# Altium schematic sheet ADC MUX.SchDoc
size 406 x 304 mm; SheetNumber: 12; SheetTotal: 18
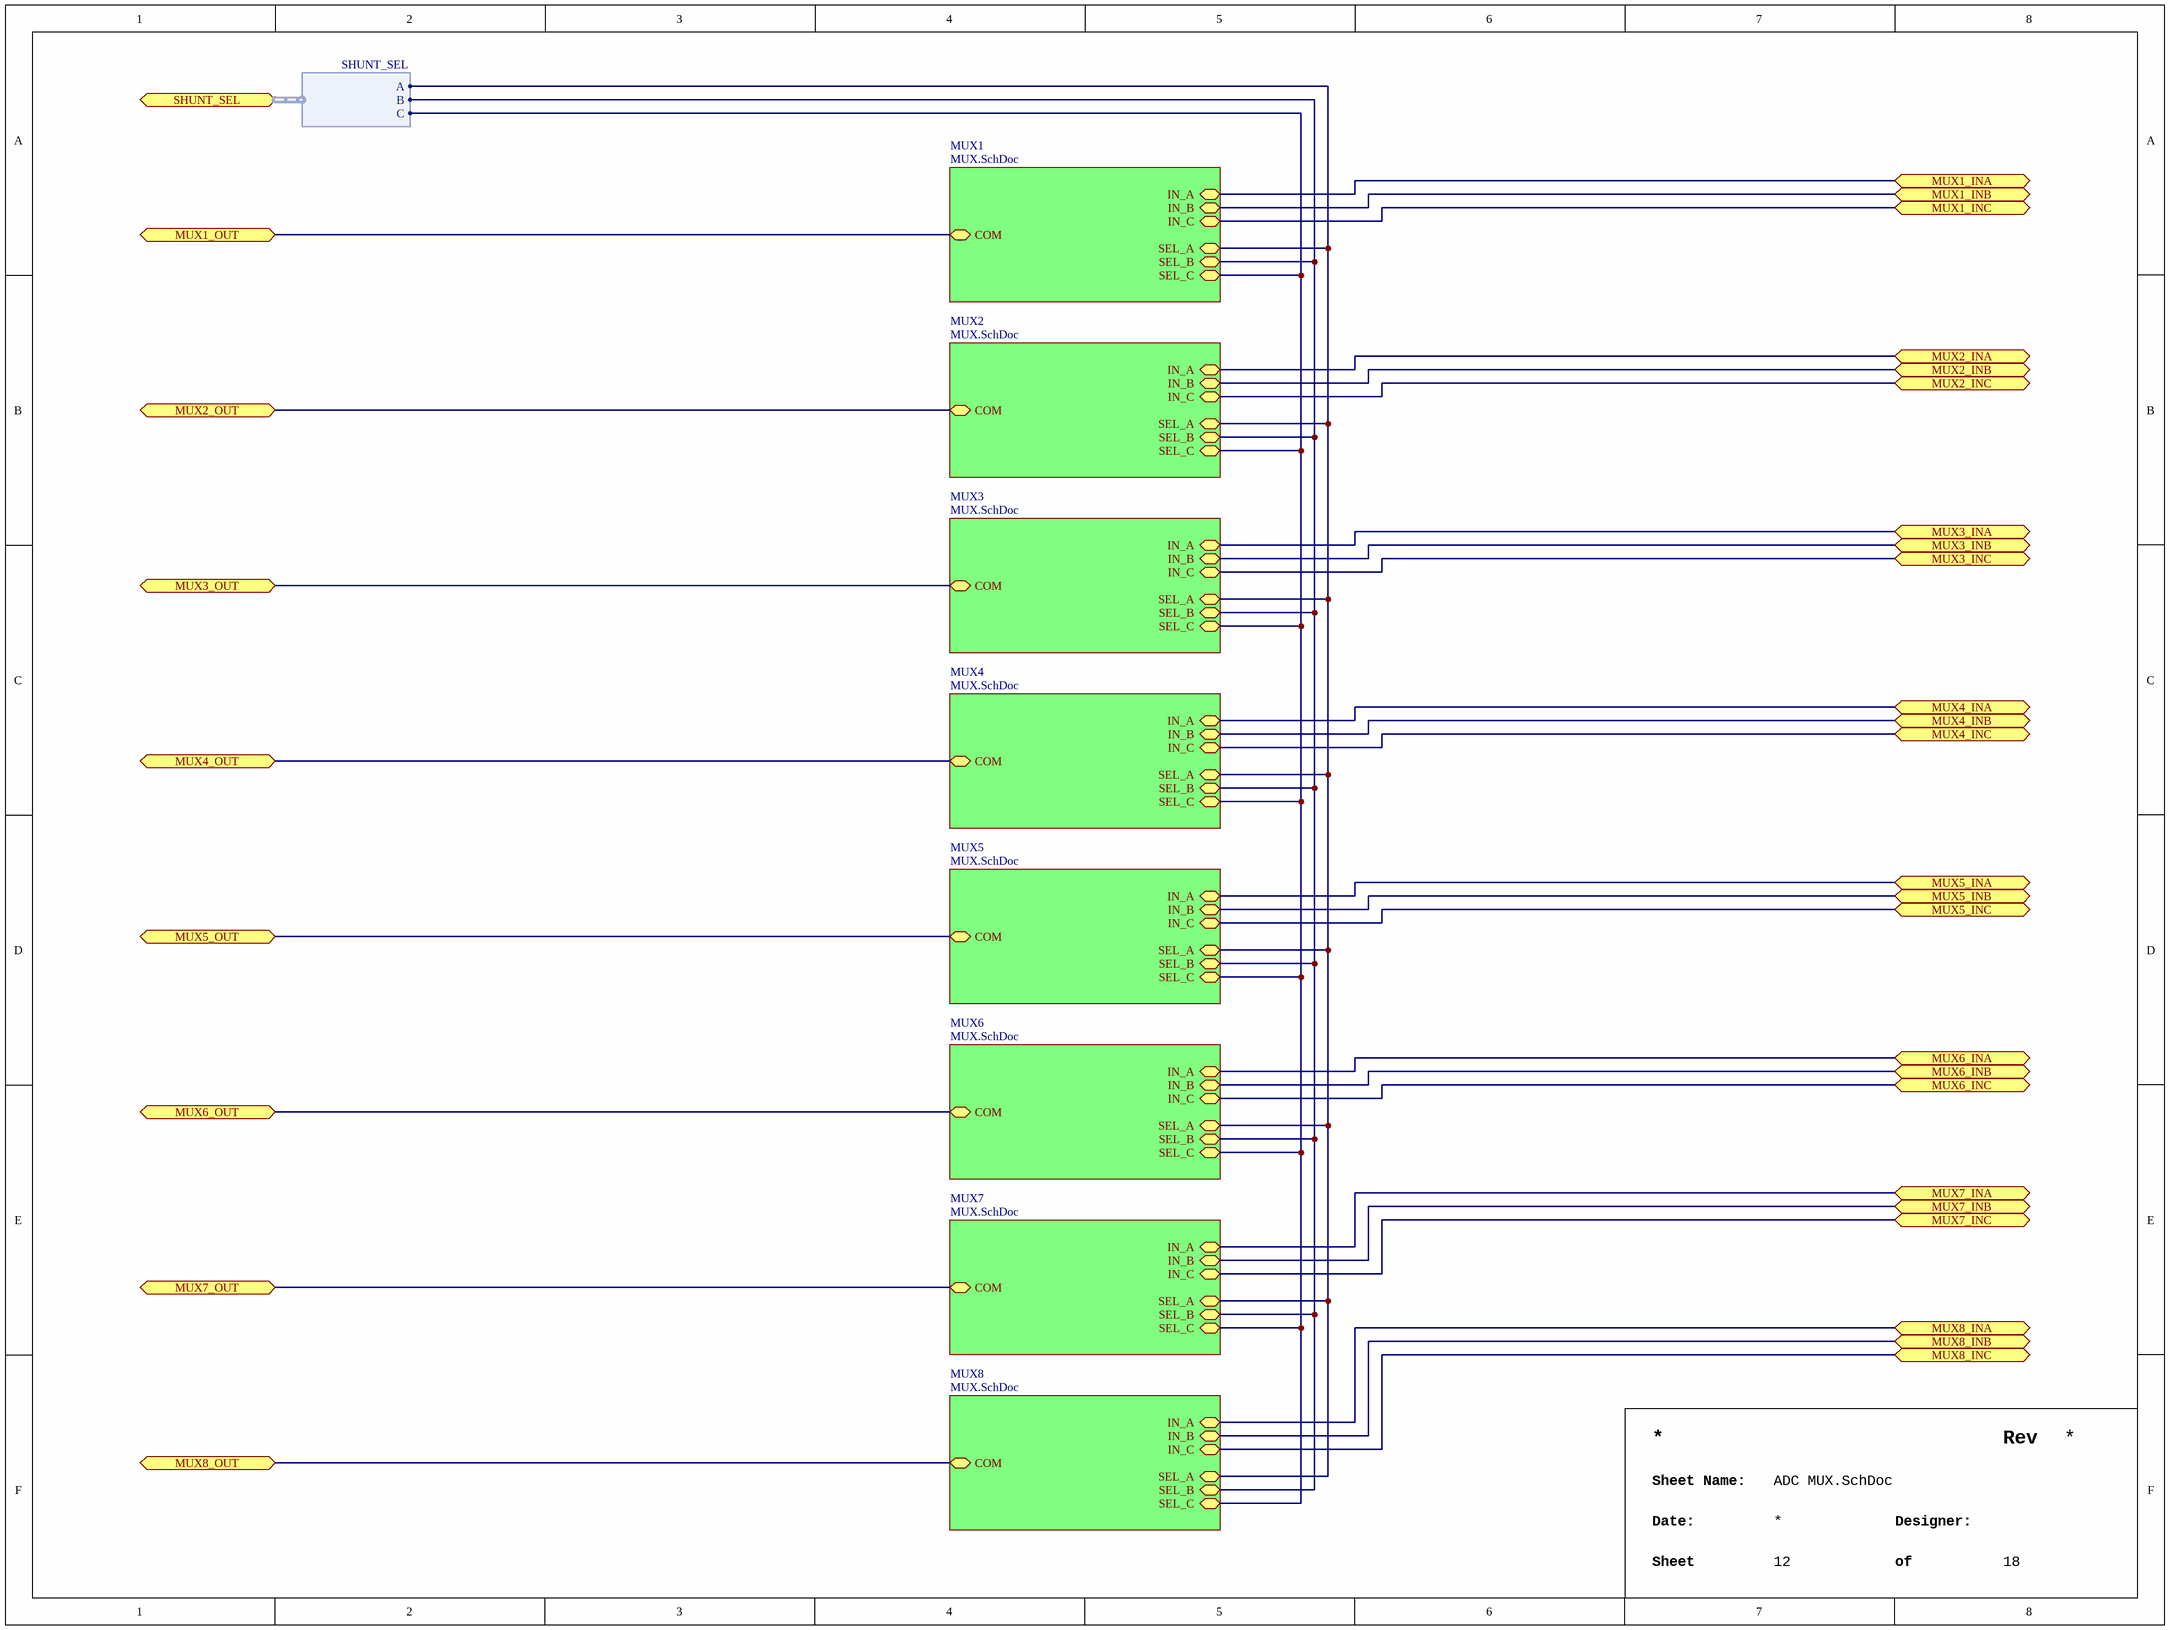
[diagram p0: ADC MUX.SchDoc]

## Sub-sheets
MUX1 = MUX.SchDoc: COM (bidir), IN_A (bidir), IN_B (bidir), IN_C (bidir), SEL_A (bidir), SEL_B (bidir), SEL_C (bidir)
MUX2 = MUX.SchDoc: COM (bidir), IN_A (bidir), IN_B (bidir), IN_C (bidir), SEL_A (bidir), SEL_B (bidir), SEL_C (bidir)
MUX3 = MUX.SchDoc: COM (bidir), IN_A (bidir), IN_B (bidir), IN_C (bidir), SEL_A (bidir), SEL_B (bidir), SEL_C (bidir)
MUX4 = MUX.SchDoc: COM (bidir), IN_A (bidir), IN_B (bidir), IN_C (bidir), SEL_A (bidir), SEL_B (bidir), SEL_C (bidir)
MUX5 = MUX.SchDoc: COM (bidir), IN_A (bidir), IN_B (bidir), IN_C (bidir), SEL_A (bidir), SEL_B (bidir), SEL_C (bidir)
MUX6 = MUX.SchDoc: COM (bidir), IN_A (bidir), IN_B (bidir), IN_C (bidir), SEL_A (bidir), SEL_B (bidir), SEL_C (bidir)
MUX7 = MUX.SchDoc: COM (bidir), IN_A (bidir), IN_B (bidir), IN_C (bidir), SEL_A (bidir), SEL_B (bidir), SEL_C (bidir)
MUX8 = MUX.SchDoc: COM (bidir), IN_A (bidir), IN_B (bidir), IN_C (bidir), SEL_A (bidir), SEL_B (bidir), SEL_C (bidir)

## Ports
MUX1_INA (bidir), MUX1_INB (bidir), MUX1_INC (bidir), MUX1_OUT (bidir), MUX2_INA (bidir), MUX2_INB (bidir), MUX2_INC (bidir), MUX2_OUT (bidir), MUX3_INA (bidir), MUX3_INB (bidir), MUX3_INC (bidir), MUX3_OUT (bidir), MUX4_INA (bidir), MUX4_INB (bidir), MUX4_INC (bidir), MUX4_OUT (bidir), MUX5_INA (bidir), MUX5_INB (bidir), MUX5_INC (bidir), MUX5_OUT (bidir), MUX6_INA (bidir), MUX6_INB (bidir), MUX6_INC (bidir), MUX6_OUT (bidir), MUX7_INA (bidir), MUX7_INB (bidir), MUX7_INC (bidir), MUX7_OUT (bidir), MUX8_INA (bidir), MUX8_INB (bidir), MUX8_INC (bidir), MUX8_OUT (bidir), SHUNT_SEL (bidir, harness SHUNT_SEL)

## Harnesses
SHUNT_SEL: A, B, C

## Nets
MUX1_INA: port MUX1_INA, sheet MUX1/IN_A
MUX1_INB: port MUX1_INB, sheet MUX1/IN_B
MUX1_INC: port MUX1_INC, sheet MUX1/IN_C
MUX1_OUT: port MUX1_OUT, sheet MUX1/COM
MUX2_INA: port MUX2_INA, sheet MUX2/IN_A
MUX2_INB: port MUX2_INB, sheet MUX2/IN_B
MUX2_INC: port MUX2_INC, sheet MUX2/IN_C
MUX2_OUT: port MUX2_OUT, sheet MUX2/COM
MUX3_INA: port MUX3_INA, sheet MUX3/IN_A
MUX3_INB: port MUX3_INB, sheet MUX3/IN_B
MUX3_INC: port MUX3_INC, sheet MUX3/IN_C
MUX3_OUT: port MUX3_OUT, sheet MUX3/COM
MUX4_INA: port MUX4_INA, sheet MUX4/IN_A
MUX4_INB: port MUX4_INB, sheet MUX4/IN_B
MUX4_INC: port MUX4_INC, sheet MUX4/IN_C
MUX4_OUT: port MUX4_OUT, sheet MUX4/COM
MUX5_INA: port MUX5_INA, sheet MUX5/IN_A
MUX5_INB: port MUX5_INB, sheet MUX5/IN_B
MUX5_INC: port MUX5_INC, sheet MUX5/IN_C
MUX5_OUT: port MUX5_OUT, sheet MUX5/COM
MUX6_INA: port MUX6_INA, sheet MUX6/IN_A
MUX6_INB: port MUX6_INB, sheet MUX6/IN_B
MUX6_INC: port MUX6_INC, sheet MUX6/IN_C
MUX6_OUT: port MUX6_OUT, sheet MUX6/COM
MUX7_INA: port MUX7_INA, sheet MUX7/IN_A
MUX7_INB: port MUX7_INB, sheet MUX7/IN_B
MUX7_INC: port MUX7_INC, sheet MUX7/IN_C
MUX7_OUT: port MUX7_OUT, sheet MUX7/COM
MUX8_INA: port MUX8_INA, sheet MUX8/IN_A
MUX8_INB: port MUX8_INB, sheet MUX8/IN_B
MUX8_INC: port MUX8_INC, sheet MUX8/IN_C
MUX8_OUT: port MUX8_OUT, sheet MUX8/COM
(unnamed): sheet MUX1/SEL_A, sheet MUX2/SEL_A, sheet MUX3/SEL_A, sheet MUX4/SEL_A, sheet MUX5/SEL_A, sheet MUX6/SEL_A, sheet MUX7/SEL_A, sheet MUX8/SEL_A, port SHUNT_SEL.A
(unnamed): sheet MUX1/SEL_B, sheet MUX2/SEL_B, sheet MUX3/SEL_B, sheet MUX4/SEL_B, sheet MUX5/SEL_B, sheet MUX6/SEL_B, sheet MUX7/SEL_B, sheet MUX8/SEL_B, port SHUNT_SEL.B
(unnamed): sheet MUX1/SEL_C, sheet MUX2/SEL_C, sheet MUX3/SEL_C, sheet MUX4/SEL_C, sheet MUX5/SEL_C, sheet MUX6/SEL_C, sheet MUX7/SEL_C, sheet MUX8/SEL_C, port SHUNT_SEL.C

## Notes on the sheet
- Rev
- Sheet Name:
- Date:
- Sheet
- Designer:
- of